# Altium schematic sheet BackEMF.SchDoc
size B; SheetNumber: 5; SheetTotal: 15
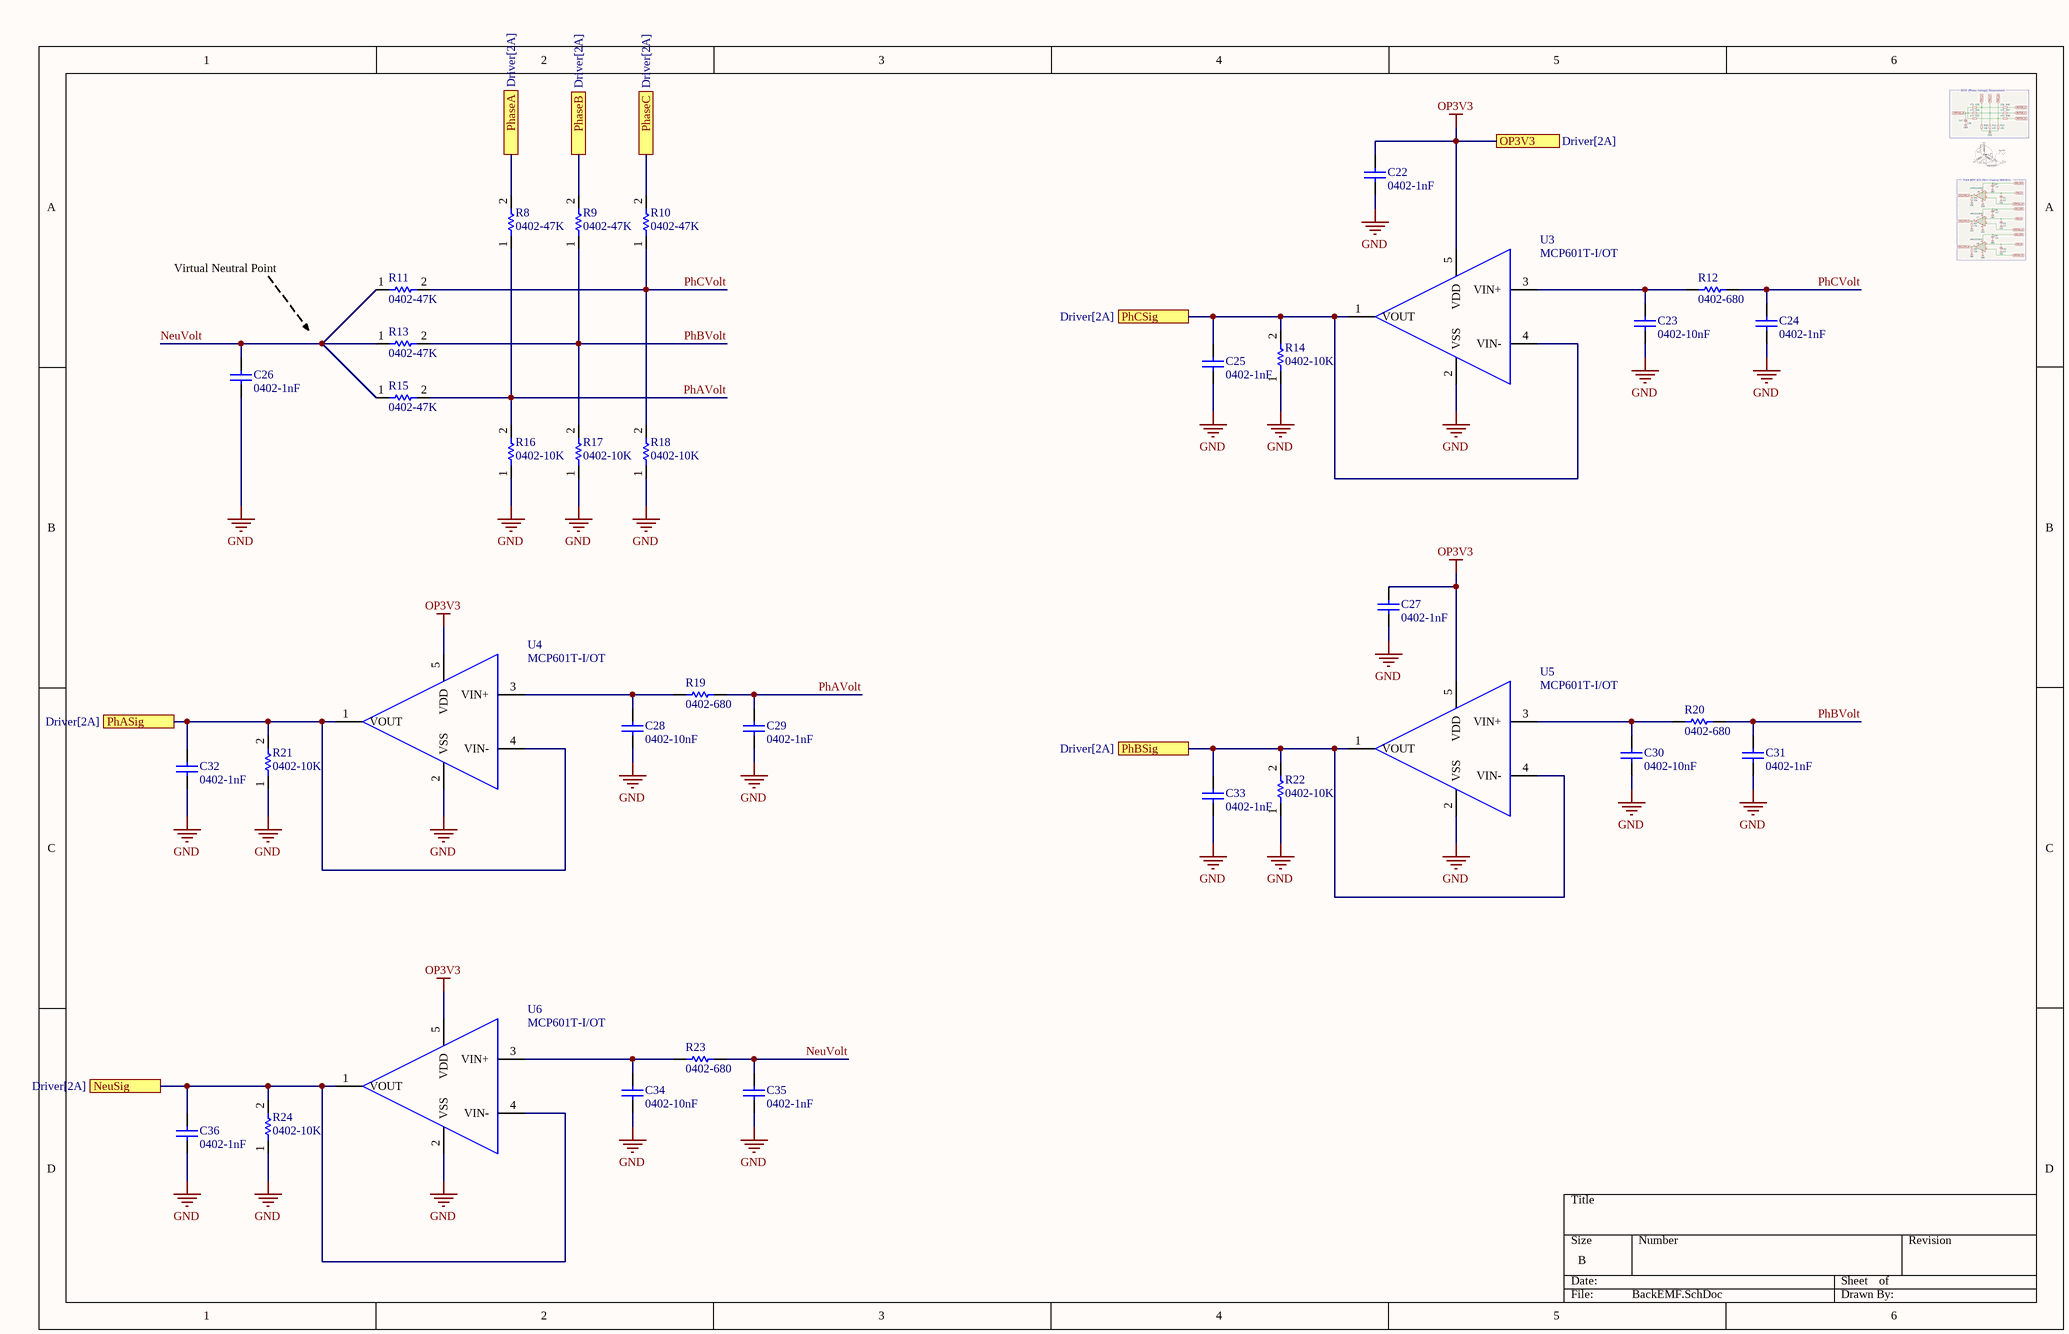
[diagram p0: BackEMF.SchDoc]

## Parts
C22  0402-1nF  [CAPC0402(1005)60_N]
C23  0402-10nF  [CAPC0402(1005)60_N]
C24  0402-1nF  [CAPC0402(1005)60_N]
C25  0402-1nF  [CAPC0402(1005)60_N]
C26  0402-1nF  [CAPC0402(1005)60_N]
C27  0402-1nF  [CAPC0402(1005)60_N]
C28  0402-10nF  [CAPC0402(1005)60_N]
C29  0402-1nF  [CAPC0402(1005)60_N]
C30  0402-10nF  [CAPC0402(1005)60_N]
C31  0402-1nF  [CAPC0402(1005)60_N]
C32  0402-1nF  [CAPC0402(1005)60_N]
C33  0402-1nF  [CAPC0402(1005)60_N]
C34  0402-10nF  [CAPC0402(1005)60_N]
C35  0402-1nF  [CAPC0402(1005)60_N]
C36  0402-1nF  [CAPC0402(1005)60_N]
R8  0402-47K  [R-0402-10K]
R9  0402-47K  [R-0402-10K]
R10  0402-47K  [R-0402-10K]
R11  0402-47K  [R-0402-10K]
R12  0402-680  [R-0402-1K]
R13  0402-47K  [R-0402-10K]
R14  0402-10K  [R-0402-10K]
R15  0402-47K  [R-0402-10K]
R16  0402-10K  [R-0402-10K]
R17  0402-10K  [R-0402-10K]
R18  0402-10K  [R-0402-10K]
R19  0402-680  [R-0402-1K]
R20  0402-680  [R-0402-1K]
R21  0402-10K  [R-0402-10K]
R22  0402-10K  [R-0402-10K]
R23  0402-680  [R-0402-1K]
R24  0402-10K  [R-0402-10K]
U3  MCP601T-I/OT  [SOT95P280X145-5N]
U4  MCP601T-I/OT  [SOT95P280X145-5N]
U5  MCP601T-I/OT  [SOT95P280X145-5N]
U6  MCP601T-I/OT  [SOT95P280X145-5N]

## Ports
NeuSig (see Driver[2A]), OP3V3 (see Driver[2A]), PhaseA (see Driver[2A]), PhaseB (see Driver[2A]), PhaseC (see Driver[2A]), PhASig (see Driver[2A]), PhBSig (see Driver[2A]), PhCSig (see Driver[2A])

## Nets
GND: C22.1 C23.1 C24.1 C25.1 C26.1 C27.1 C28.1 C29.1 C30.1 C31.1 C32.1 C33.1 C34.1 C35.1 C36.1 R14.1 R16.1 R17.1 R18.1 R21.1 R22.1 R24.1 U3.2(VSS) U4.2(VSS) U5.2(VSS) U6.2(VSS)
OP3V3: C22.2 C27.2 U3.5(VDD) U4.5(VDD) U5.5(VDD) U6.5(VDD) ; port OP3V3
NeuSig: C36.2 R24.2 U6.1(VOUT) U6.4(VIN-) ; port NeuSig
NeuVolt: C26.2 C35.2 R11.1 R13.1 R15.1 R23.2
PhaseA: R8.2 ; port PhaseA
PhaseB: R9.2 ; port PhaseB
PhaseC: R10.2 ; port PhaseC
PhASig: C32.2 R21.2 U4.1(VOUT) U4.4(VIN-) ; port PhASig
PhAVolt: C29.2 R8.1 R15.2 R16.2 R19.2
PhBSig: C33.2 R22.2 U5.1(VOUT) U5.4(VIN-) ; port PhBSig
PhBVolt: C31.2 R9.1 R13.2 R17.2 R20.2
PhCSig: C25.2 R14.2 U3.1(VOUT) U3.4(VIN-) ; port PhCSig
PhCVolt: C24.2 R10.1 R11.2 R12.2 R18.2
NetC23_2: C23.2 R12.1 U3.3(VIN+)
NetC28_2: C28.2 R19.1 U4.3(VIN+)
NetC30_2: C30.2 R20.1 U5.3(VIN+)
NetC34_2: C34.2 R23.1 U6.3(VIN+)

## Notes on the sheet
- Virtual Neutral Point

## Library data of the parts
C22 C24-C27 C29 C31-C33 C35 C36 = CMP-001-00357-4: Capacitor 1nF 0402; Tolerance: 20%; Dielectric: X5R; Voltage Rating: 4V; Value: 1nF; Min Operating Temperature: -55°C; Component Type: Standard; Termination: SMD/SMT; Height: 0.5mm; Construction: Flat; RoHS Compliant: Yes; Voltage Rating (DC): 4V; Mount: Surface Mount; Case Code (Metric): 1005; Pins: 2; Package Quantity: 1; Max Operating Temperature: 85°C; Length: 0.039inch; Source: 0402-10uF.SchLib; Design Item ID: CMP-1034-02139-2; Case/Package: 0402; Series: M; Packaging: Tape and Reel; Halogen Free: Halogen Free; Thickness: 0.028inch; Width: 0.02inch
C23 C28 C30 C34 = CMP-001-00355-4: Capacitor 10nF 0402; Tolerance: 20%; Dielectric: X5R; Voltage Rating (DC): 4V; Height: 0.5mm; Mount: Surface Mount; Min Operating Temperature: -55°C; Max Operating Temperature: 85°C; RoHS Compliant: Yes; Source: 0402-10uF.SchLib; Width: 0.02inch; Pins: 2; Value: 10nF; Case/Package: 0402; Halogen Free: Halogen Free; Case Code (Metric): 1005; Construction: Flat; Termination: SMD/SMT; Design Item ID: CMP-1034-02139-2; Component Type: Standard; Thickness: 0.028inch; Packaging: Tape and Reel; Series: M; Package Quantity: 1; Length: 0.039inch; Voltage Rating: 4V
R8-R11 R13 R15 = CMP-009-00680-1: RES 0402 47K; Value: 47k
R12 R19 R20 R23 = CMP-009-00691-1: 0402Resistor 680Ohm; Value: 680
R14 R16-R18 R21 R22 R24 = CMP-009-00675-4: RES 0402 10K; Value: 10k
U3-U6 = CMP-014-00080-6: General Purpose Amplifier 1 Circuit Rail-to-Rail SOT-23-5; MF: Microchip; Pins: 5; Source: SnapEDAsch.SchLib; Design Item ID: MCP601T-I/OT; Availability: Unavailable; Case/Package: SOT-23 Microchip; Price: None; SnapEDA_Link: https://www.snapeda.com/parts/MCP601T-I/OT/Microchip/view-part/43729/?ref=snap; Component Type: Standard; MP: MCP601T-I/OT; Value: *